# EasyEDA schematic ESP32.json
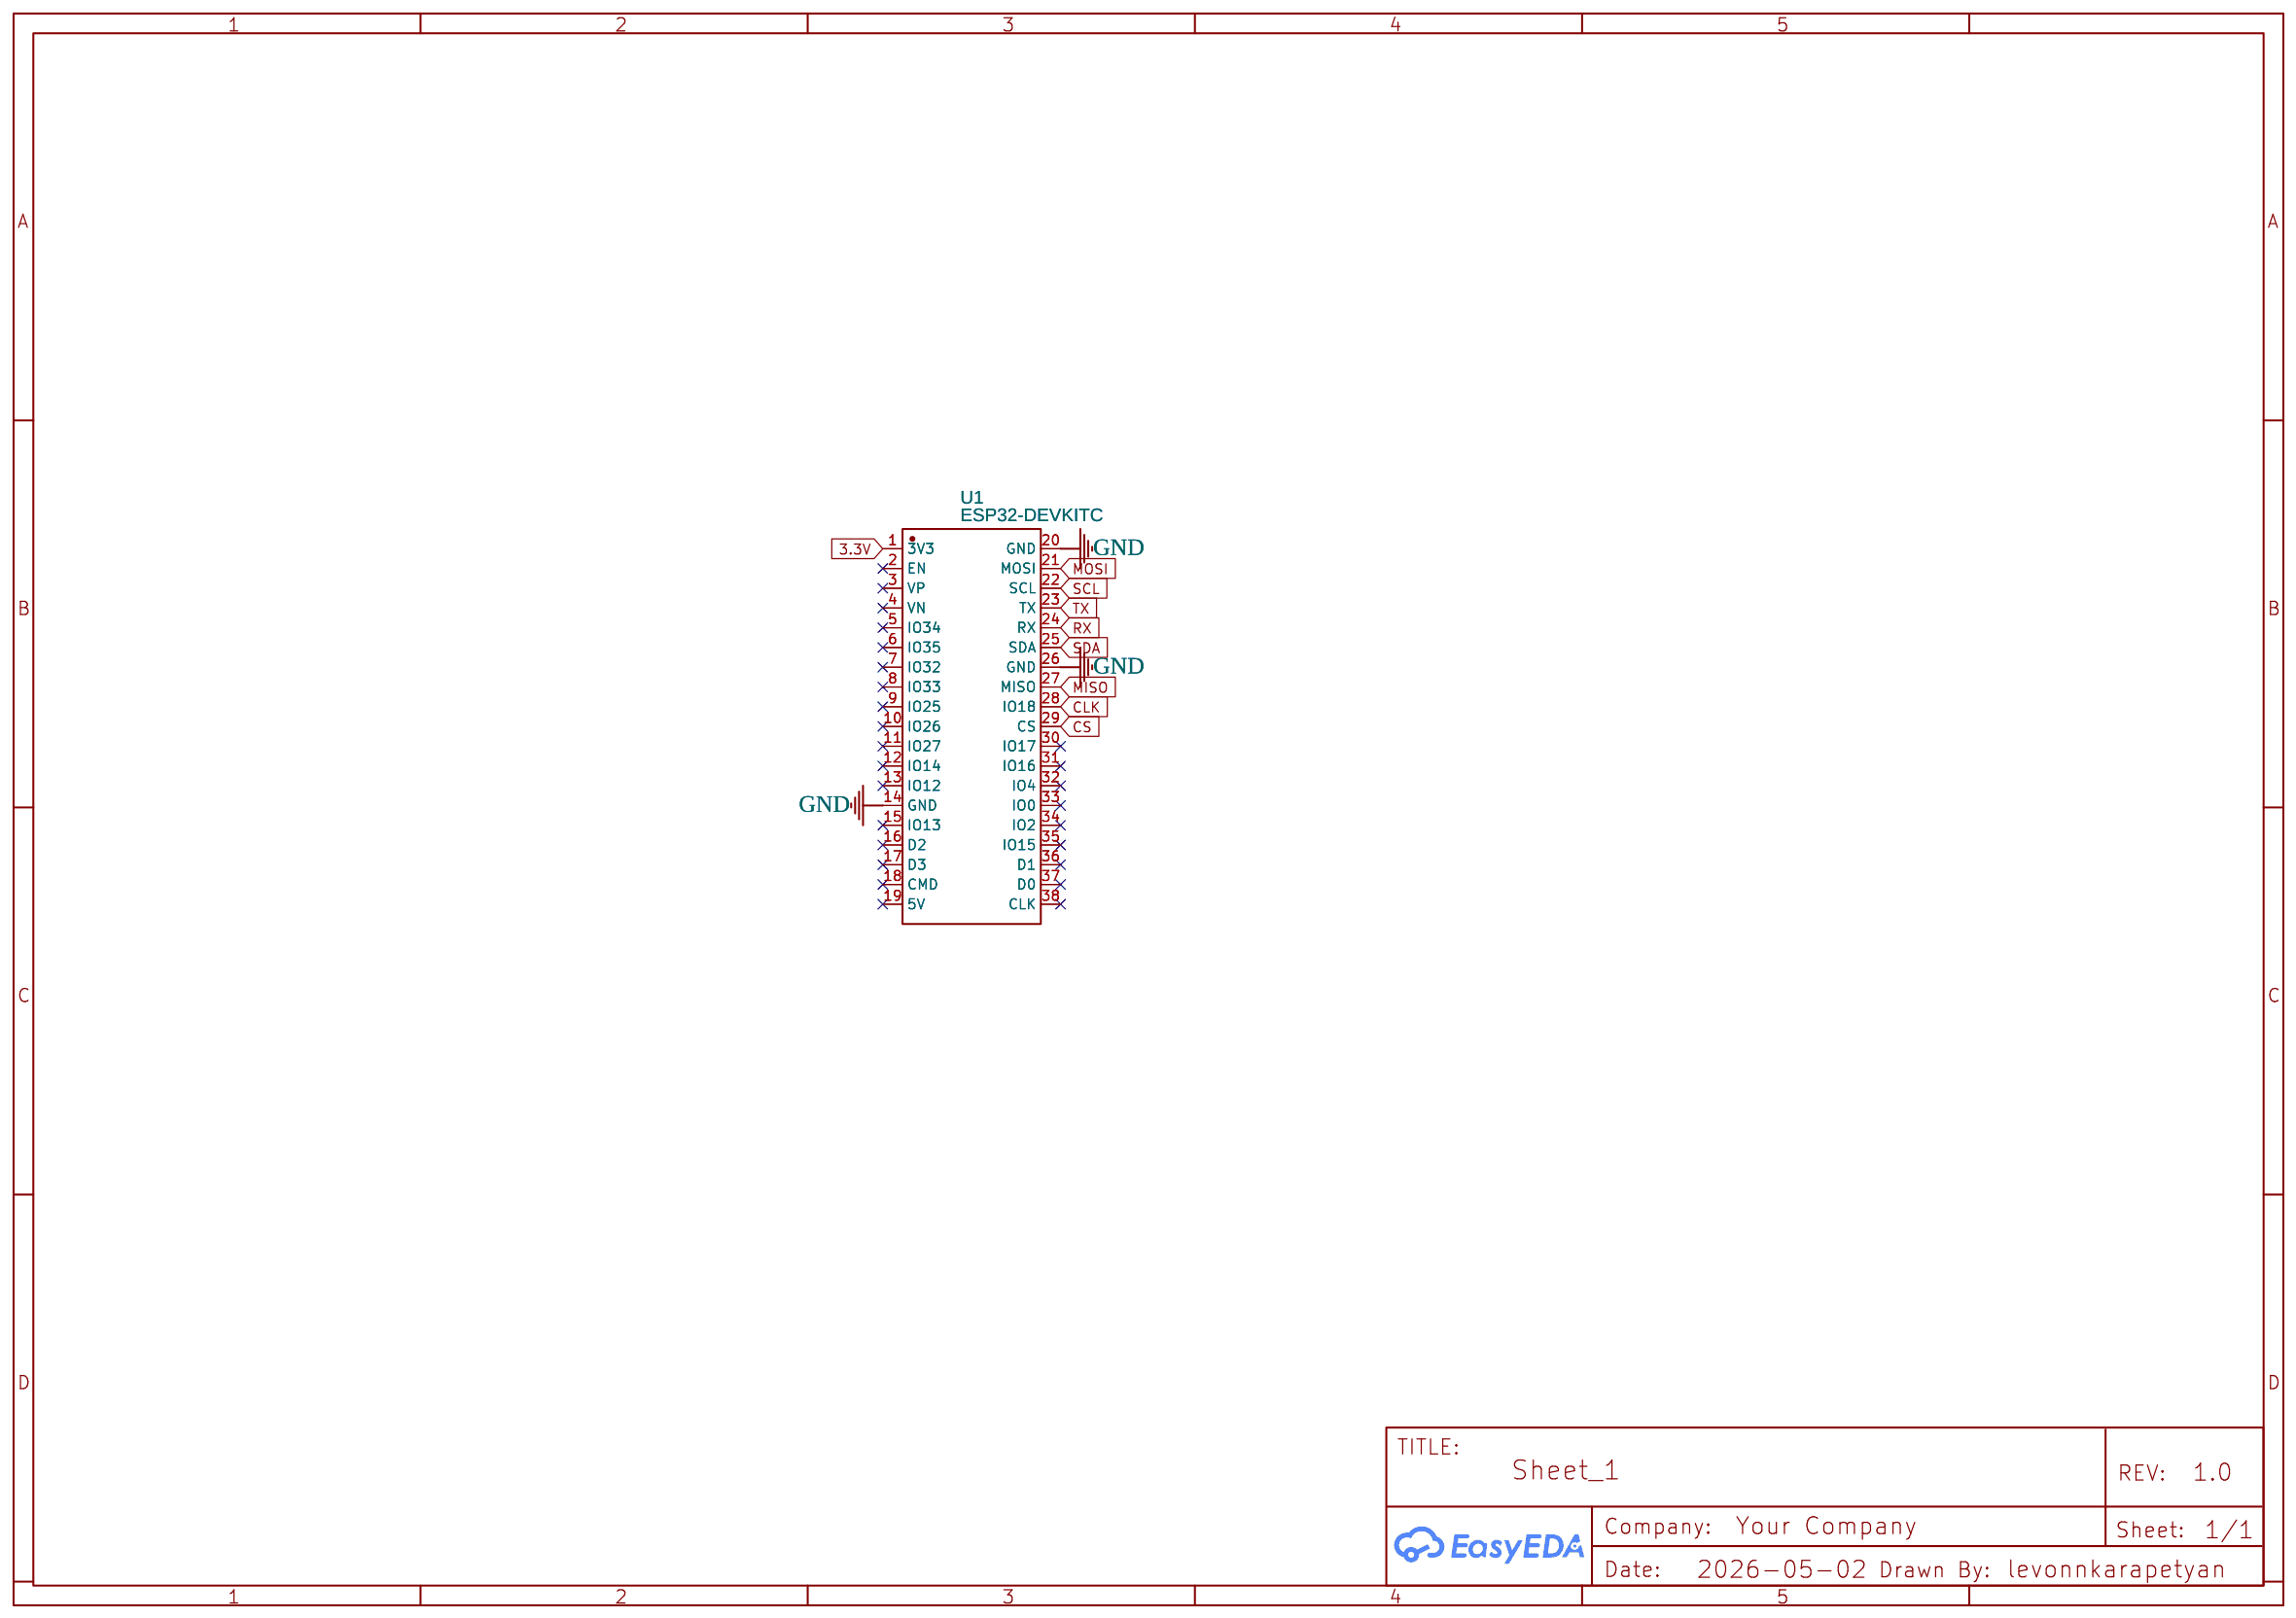
[diagram p0: schematic sheet]

## Parts
U1  ESP32-DEVKITC  [BULETM-SMD_ESP32-DEVKITC]

## Library data of the parts
U1 = ESP32-DEVKITC: Supplier: LCSC; Supplier Part: C571180; Manufacturer: ESPRESSIF(乐鑫); Manufacturer Part: ESP32-DevKitC; Contributor: lcsc

## Nets
3.3V: U1.1(3V3)
GND: U1.14(GND) U1.20(GND) U1.26(GND)
CLK: U1.28(IO18)
CS: U1.29(CS)
MISO: U1.27(MISO)
MOSI: U1.21(MOSI)
RX: U1.24(RX)
SCL: U1.22(SCL)
SDA: U1.25(SDA)
TX: U1.23(TX)

Not connected (* = marked no-connect by the designer): U1 2(EN)* 3(VP)* 4(VN)* 5(IO34)* 6(IO35)* 7(IO32)* 8(IO33)* 9(IO25)* 10(IO26)* 11(IO27)* 12(IO14)* 13(IO12)* 15(IO13)* 16(D2)* 17(D3)* 18(CMD)* 19(5V)* 30(IO17)* 31(IO16)* 32(IO4)* 33(IO0)* 34(IO2)* 35(IO15)* 36(D1)* 37(D0)* 38(CLK)*
